# EAGLE design MD201x (EAGLE 9.5.2)

## Sheet 1 of 4
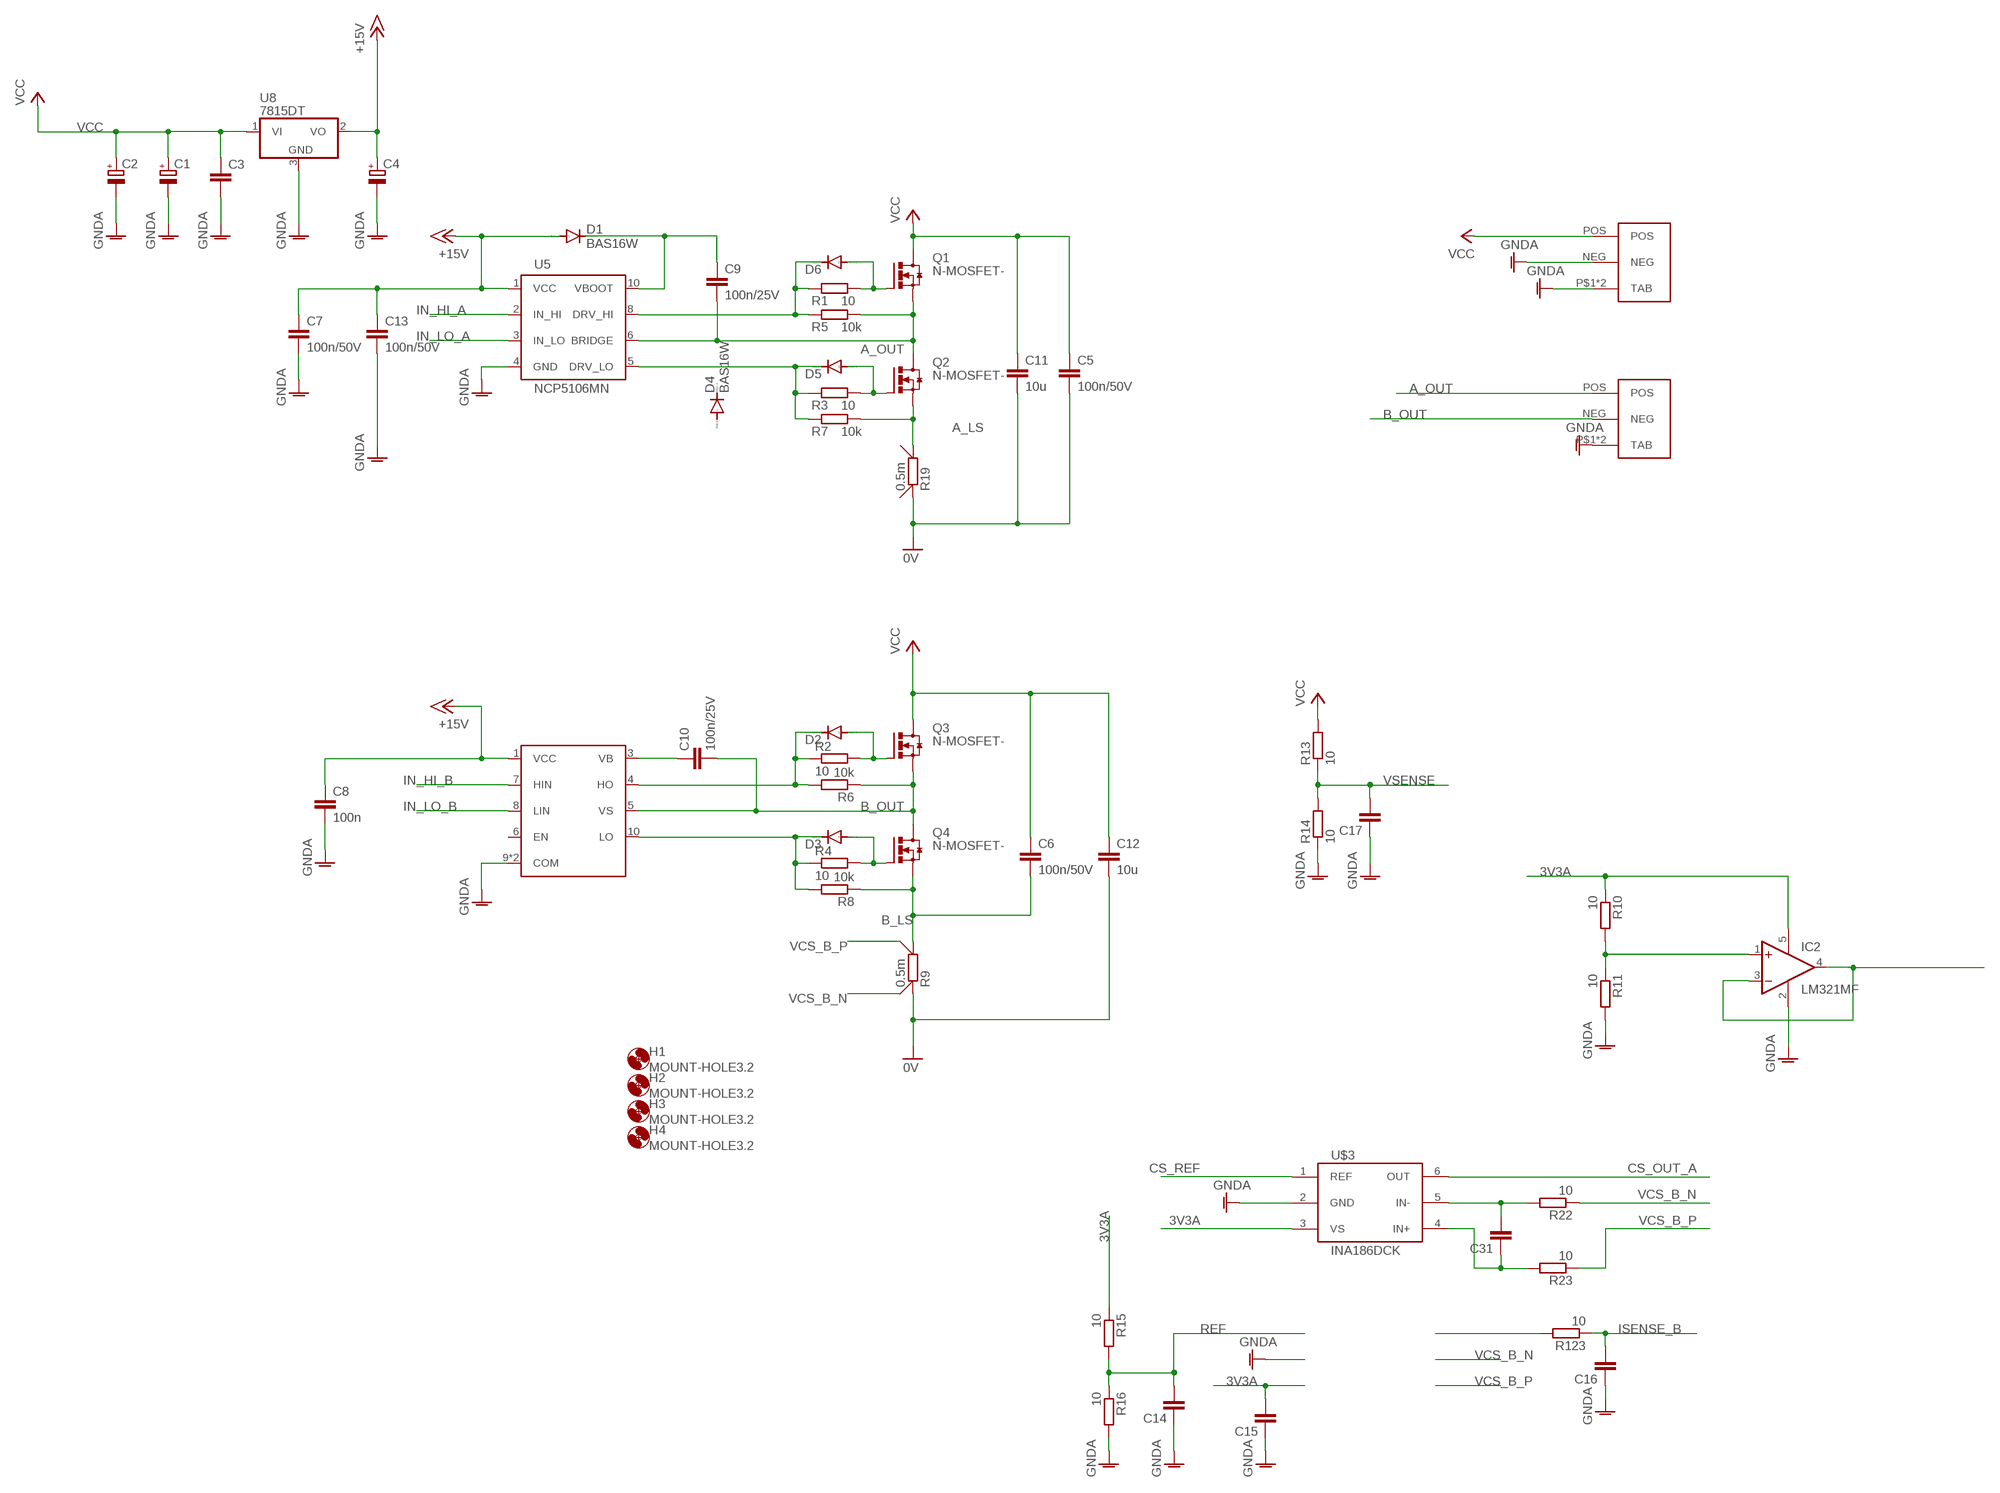
[diagram p0: schematic, sheet 1]

### Parts
C1  CPOL-EUE5-10.5  [E5-10,5]
C2  CPOL-EUE5-10.5  [E5-10,5]
C3  C-EUC0603  [C0603]
C4  CPOL-EUE2.5-5  [E2,5-5]
C5  100n/50V  C-EUC0603  [C0603]
C6  100n/50V  C-EUC0603  [C0603]
C7  100n/50V  C-EUC0603  [C0603]
C8  100n  C-EUC0603  [C0603]
C9  100n/25V  C-EUC0603  [C0603]
C10  100n/25V  C-EUC0603  [C0603]
C11  10u  C-EUC1210  [C1210]
C12  10u  C-EUC1210  [C1210]
C13  100n/50V  C-EUC0603  [C0603]
C14  C-EUC0603  [C0603]
C15  C-EUC0603  [C0603]
C16  C-EUC0603  [C0603]
C17  C-EUC0603  [C0603]
C31  C-EUC0603  [C0603]
D1  BAS16W  DIODE-SOD323-R  [SOD323-R]
D2  DIODE-SOD523  [SOD523]
D3  DIODE-SOD523  [SOD523]
D4  BAS16W  DIODE-SOD323-R  [SOD323-R]
D5  DIODE-SOD523  [SOD523]
D6  DIODE-SOD523  [SOD523]
H1  MOUNT-HOLE3.2  [3,2]
H2  MOUNT-HOLE3.2  [3,2]
H3  MOUNT-HOLE3.2  [3,2]
H4  MOUNT-HOLE3.2  [3,2]
IC2  LM321MF  [SOT23-5]
Q1  N-MOSFET-  [SOT669]
Q2  N-MOSFET-  [SOT669]
Q3  N-MOSFET-  [SOT669]
Q4  N-MOSFET-  [SOT669]
R1  10  R-EU_R0603  [R0603]
R2  10  R-EU_R0603  [R0603]
R3  10  R-EU_R0603  [R0603]
R4  10  R-EU_R0603  [R0603]
R5  10k  R-EU_R0603  [R0603]
R6  10k  R-EU_R0603  [R0603]
R7  10k  R-EU_R0603  [R0603]
R8  10k  R-EU_R0603  [R0603]
R9  0.5m  CSS2H-2512  [CSS2H-2512]
R10  10  R-EU_R0603  [R0603]
R11  10  R-EU_R0603  [R0603]
R13  10  R-EU_R0603  [R0603]
R14  10  R-EU_R0603  [R0603]
R15  10  R-EU_R0603  [R0603]
R16  10  R-EU_R0603  [R0603]
R19  0.5m  CSS2H-2512  [CSS2H-2512]
R22  10  R-EU_R0603  [R0603]
R23  10  R-EU_R0603  [R0603]
R123  10  R-EU_R0603  [R0603]
U5  NCP5106MN  [SON80P400X400X100-11T275X300]
U8  7815DT  [TO252]
U$1  XT60PW-M  [XT60PW-M]
U$2  XT60PW-F  [XT60PW-F]
U$3  INA186DCK  [SOT65P210X110-6]
U$4  DGD05473FN  [SON50P300X300X80-11T165X260]

### Nets
0V: C5.2 C11.2 C12.2 R9.1 R19.1
3V3A: C15.2 IC2.5(V+) R10.1 R15.1 U$3.3(VS) ; also sheet 3
+15V: C4.+ C7.1 C8.1 C13.1 D1.A U5.1(VCC) U8.2(VO) U$4.1(VCC) ; also sheet 4
A_LS: Q2.1(SOURCE) Q2.2(SOURCE) Q2.3(SOURCE) R7.1 R19.2
A_OUT: C9.2 Q1.1(SOURCE) Q1.2(SOURCE) Q1.3(SOURCE) Q2.5(DRAIN) R5.1 U5.6(BRIDGE) U$2.POS
B_LS: C6.2 Q4.1(SOURCE) Q4.2(SOURCE) Q4.3(SOURCE) R8.1 R9.2
B_OUT: C10.2 Q3.1(SOURCE) Q3.2(SOURCE) Q3.3(SOURCE) Q4.5(DRAIN) R6.1 U$2.NEG U$4.5(VS)
CS_OUT_A: U$3.6(OUT)
CS_REF: U$3.1(REF)
GNDA: C1.- C2.- C3.2 C4.- C7.2 C8.2 C13.2 C14.1 C15.1 C16.1 C17.1 IC2.2(V-) R11.2 R14.1 R16.2 U5.4(GND) U8.3(GND) U$1.NEG U$1.P$1(TAB) U$1.P$2(TAB) U$2.P$1(TAB) U$2.P$2(TAB) U$3.2(GND) U$4.9(COM) U$4.11(COM) ; also sheet 2,3,4
IN_HI_A: U5.2(IN_HI) ; also sheet 3
IN_HI_B: U$4.7(HIN) ; also sheet 3
IN_LO_A: U5.3(IN_LO)
IN_LO_B: U$4.8(LIN)
ISENSE_B: C16.2 R123.1
N$1: D6.C R1.1 R5.2 U5.8(DRV_HI)
N$2: D2.C R2.1 R6.2 U$4.4(HO)
N$4: D6.A Q1.4(GATE) R1.2
N$5: D3.C R4.1 R8.2 U$4.10(LO)
N$6: R123.2
N$11: D5.C R3.1 R7.2 U5.5(DRV_LO)
N$12: D2.A Q3.4(GATE) R2.2
N$14: IC2.1(+IN) R10.2 R11.1
N$15: C31.2 R22.2 U$3.5(IN-)
N$22: C31.1 R23.2 U$3.4(IN+)
N$24: IC2.3(-IN) IC2.4(OUT)
N$61: D5.A Q2.4(GATE) R3.2
N$64: D3.A Q4.4(GATE) R4.2
N$67: C10.1 U$4.3(VB)
N$73: C9.1 D1.C U5.10(VBOOT)
REF: C14.2 R15.2 R16.1
VCC: C1.+ C2.+ C3.1 C5.1 C6.1 C11.1 C12.1 Q1.5(DRAIN) Q3.5(DRAIN) R13.2 U8.1(VI) U$1.POS
VCS_B_N: R9.1S R22.1
VCS_B_P: R9.2S R23.1
VSENSE: C17.2 R13.1 R14.2 ; also sheet 3
Unconnected: D4.A D4.C R19.1S R19.2S U$4.6(EN)

## Sheet 2 of 4
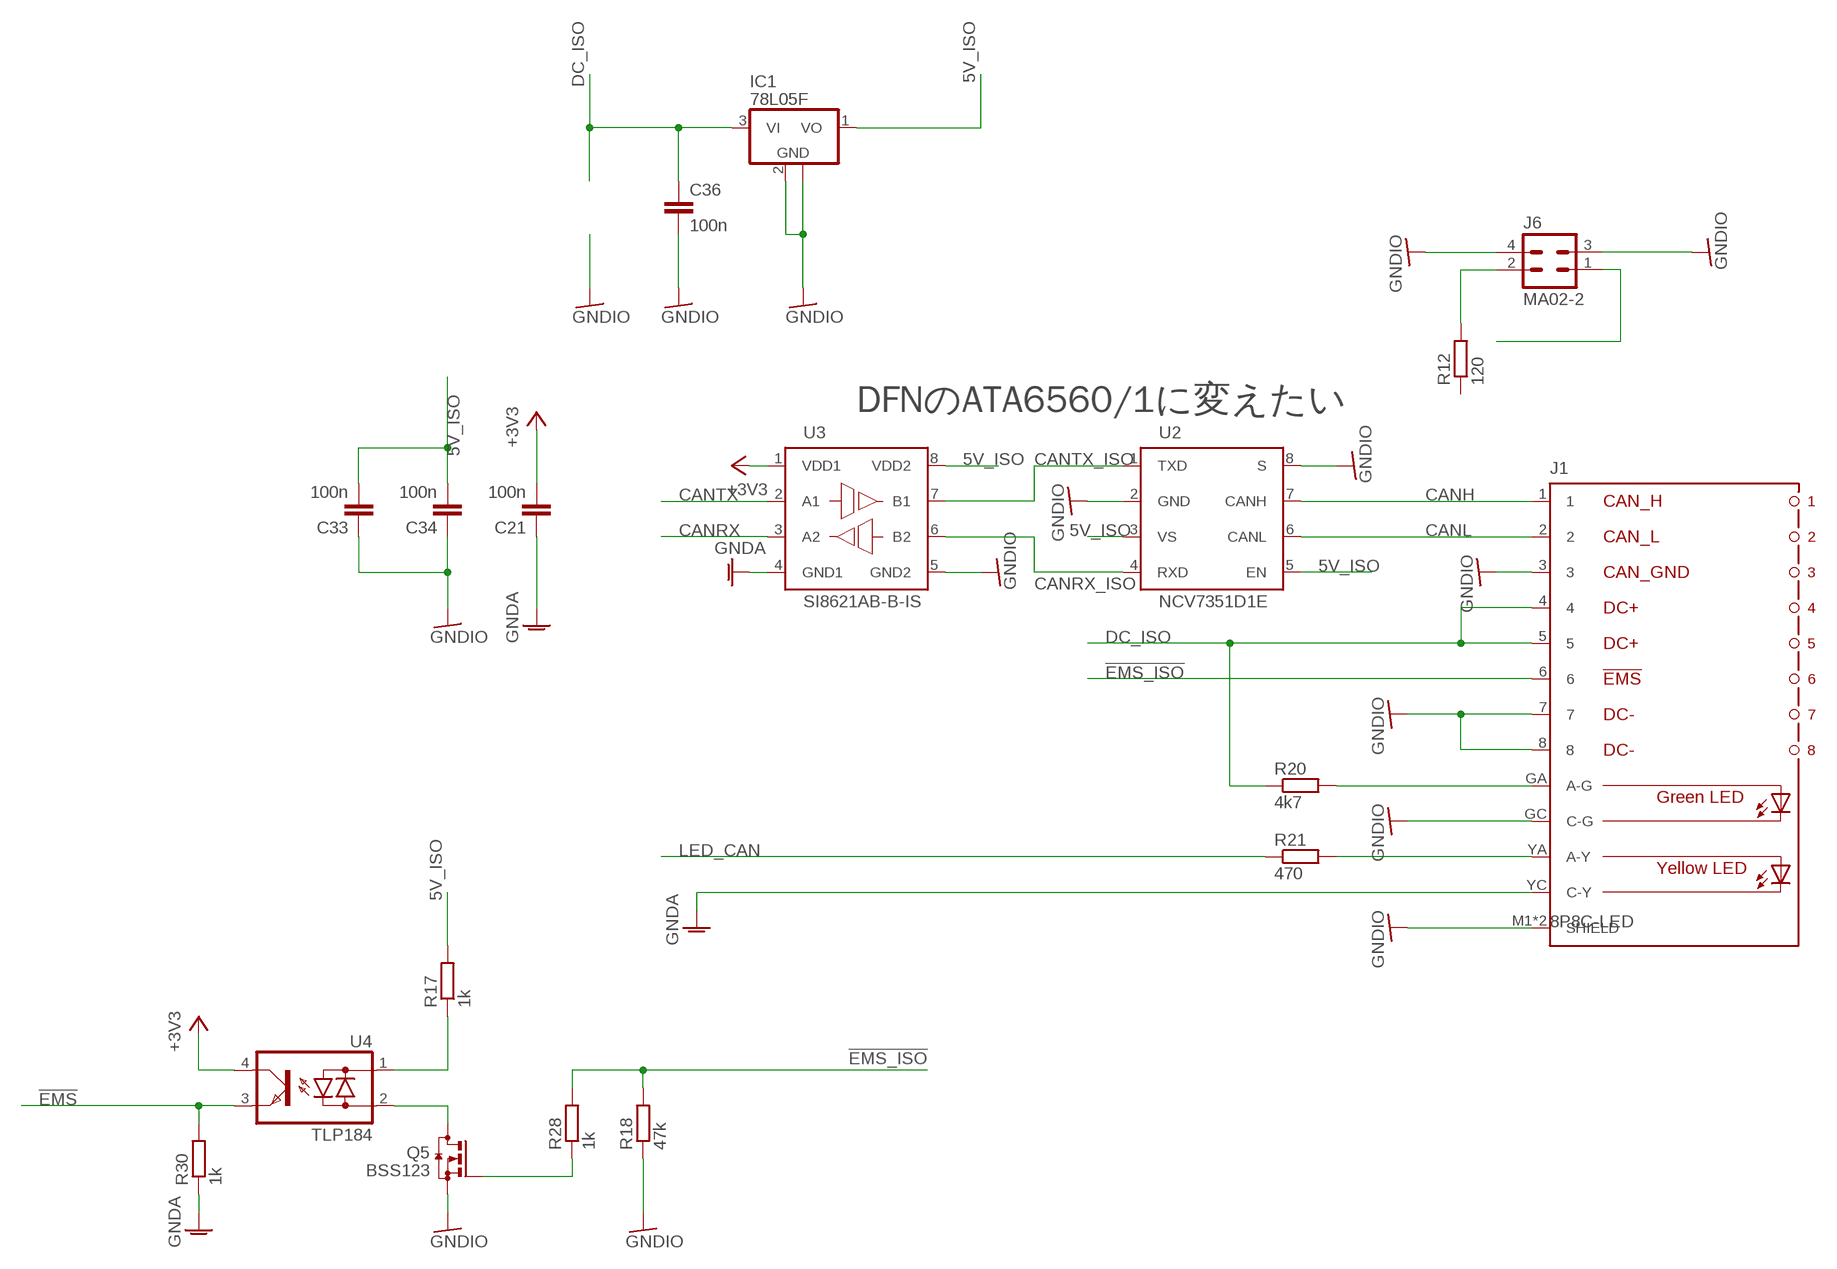
[diagram p1: schematic, sheet 2]

### Parts
C21  100n  C-EUC0603  [C0603]
C33  100n  C-EUC0603  [C0603]
C34  100n  C-EUC0603  [C0603]
C36  100n  C-EUC1210  [C1210]
IC1  78L05F  [SOT89]
J1  8P8C-LED  [8P8C-LED]
J6  MA02-2  [MA02-2W]
Q5  BSS123  [SOT23]
R12  120  R-EU_R0603  [R0603]
R17  1k  R-EU_R0603  [R0603]
R18  47k  R-EU_R0603  [R0603]
R20  4k7  R-EU_R0603  [R0603]
R21  470  R-EU_R0603  [R0603]
R28  1k  R-EU_R0603  [R0603]
R30  1k  R-EU_R0603  [R0603]
U2  NCV7351D1E  [SO08]
U3  SI8621AB-B-IS  [SO08]
U4  TLP184  [11-4M1S]

### Nets
5V_ISO: C33.2 C34.2 IC1.1(VO) R17.2 U2.3(VS) U2.5(EN) U3.8(VDD2)
!EMS: R30.2 U4.3(E) ; also sheet 3
!EMS_ISO: J1.6 R18.2 R28.2
+3V3: C21.2 U3.1(VDD1) U4.4(C) ; also sheet 3,4
CANH: J1.1 U2.7(CANH)
CANL: J1.2 U2.6(CANL)
CANRX: U3.3(A2) ; also sheet 3
CANRX_ISO: U2.4(RXD) U3.6(B2)
CANTX: U3.2(A1) ; also sheet 3
CANTX_ISO: U2.1(TXD) U3.7(B1)
DC_ISO: C36.1 IC1.3(VI) J1.4 J1.5 R20.1
GNDA: C21.1 J1.YC(C-Y) R30.1 U3.4(GND1) ; also sheet 1,3,4
GNDIO: C33.1 C34.1 C36.2 IC1.2(GND) IC1.2@1(GND) J1.3 J1.7 J1.8 J1.GC(C-G) J1.M1(SHIELD) J1.M2(SHIELD) J6.3 J6.4 Q5.2(S) R18.1 U2.2(GND) U2.8(S) U3.5(GND2)
LED_CAN: R21.1 ; also sheet 3
N$8: Q5.1(G) R28.1
N$9: J6.2 R12.2
N$13: J6.1
N$16: R17.1 U4.1(AC1)
N$17: Q5.3(D) U4.2(AC2)
N$18: J1.GA(A-G) R20.2
N$20: J1.YA(A-Y) R21.2
Unconnected: R12.1

### Notes on the sheet
- DFNのATA6560/1に変えたい

## Sheet 3 of 4
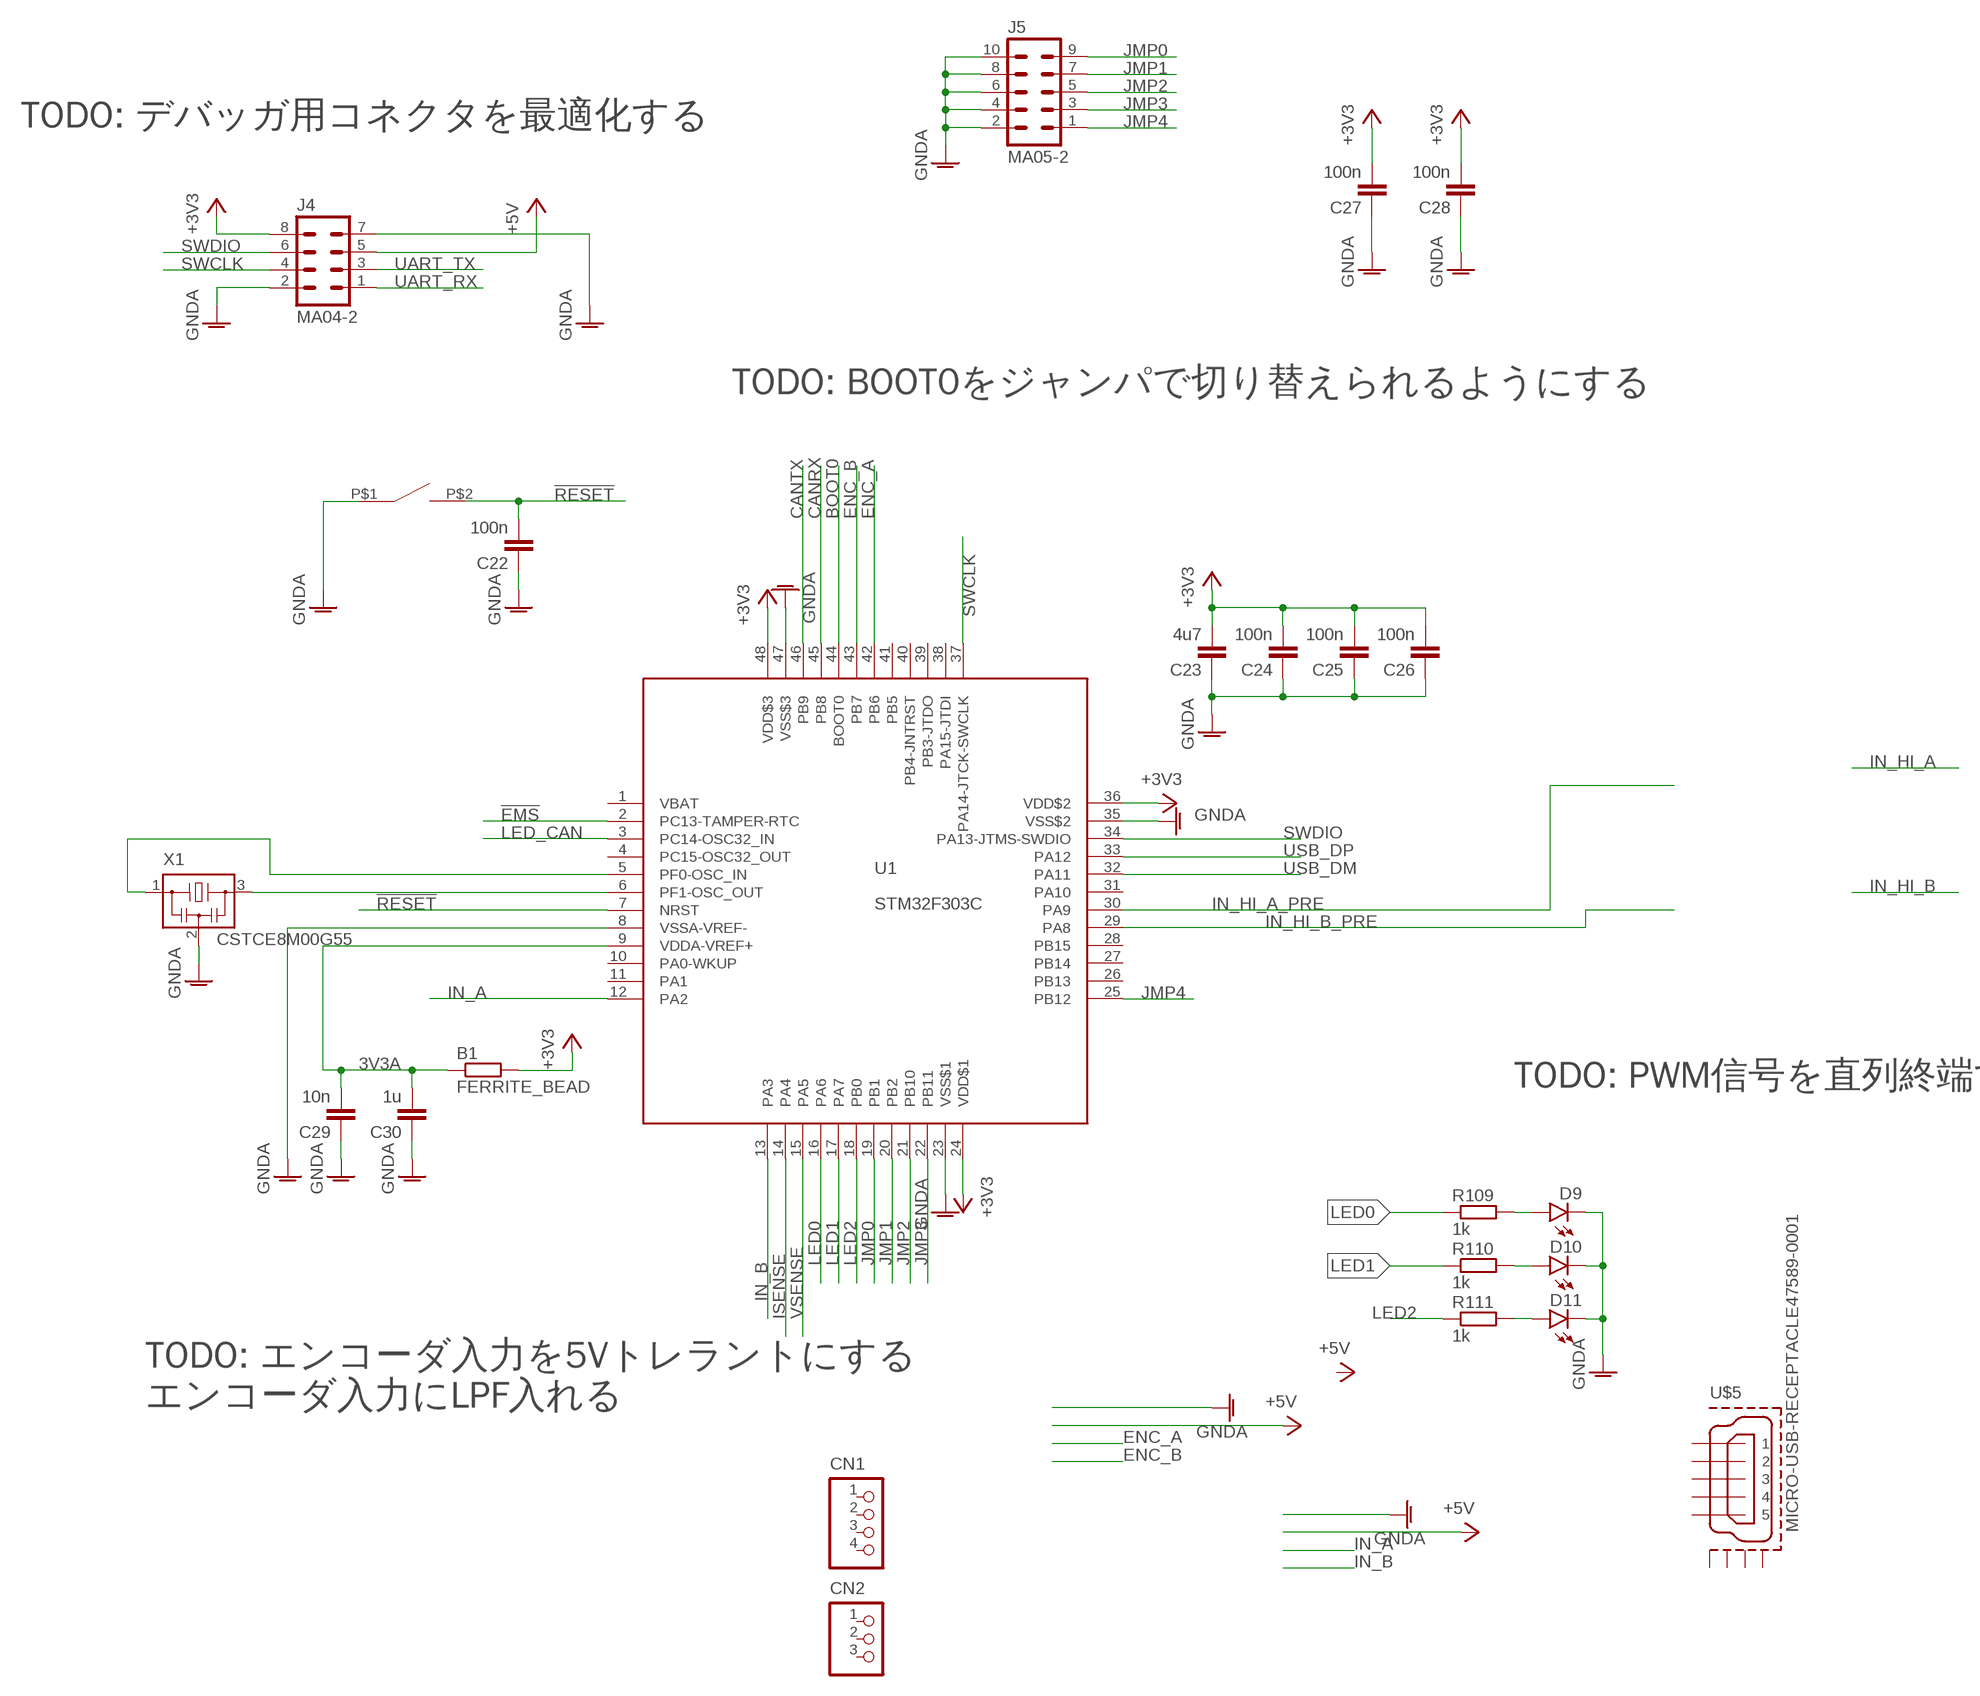
[diagram p2: schematic, sheet 3]

### Parts
B1  FERRITE_BEAD  R-EU_R0603  [R0603]
C22  100n  C-EUC0603  [C0603]
C23  4u7  C-EUC0805  [C0805]
C24  100n  C-EUC0603  [C0603]
C25  100n  C-EUC0603  [C0603]
C26  100n  C-EUC0603  [C0603]
C27  100n  C-EUC0603  [C0603]
C28  100n  C-EUC0603  [C0603]
C29  10n  C-EUC0603  [C0603]
C30  1u  C-EUC0603  [C0603]
CN1  S4B-XASK-1  [S4B-XASK-1]
CN2  S3B-XASK-1  [S3B-XASK-1]
D9  LEDCHIPLED_0805  [CHIPLED_0805]
D10  LEDCHIPLED_0805  [CHIPLED_0805]
D11  LEDCHIPLED_0805  [CHIPLED_0805]
J4  MA04-2  [MA04-2W]
J5  MA05-2  [MA05-2W]
R109  1k  R-EU_R0603  [R0603]
R110  1k  R-EU_R0603  [R0603]
R111  1k  R-EU_R0603  [R0603]
S1  SWITCH_TACTILETOP  [SWITCH_TACTILE_3X6]
U1  STM32F303C  [LQFP48]
U$5  MICRO-USB-RECEPTACLE47589-0001  [47589-0001]
X1  CSTCE8M00G55  [CSTCE8M00G55]

### Nets
3V3A: B1.1 C29.2 C30.2 U1.9(VDDA-VREF+) ; also sheet 1
!EMS: U1.2(PC13-TAMPER-RTC) ; also sheet 2
!RESET: C22.2 S1.P$2 U1.7(NRST)
+3V3: B1.2 C23.2 C24.2 C25.2 C26.2 C27.2 C28.2 J4.8 U1.24(VDD$1) U1.36(VDD$2) U1.48(VDD$3) ; also sheet 2,4
+5V: J4.5 ; also sheet 4
BOOT0: U1.44(BOOT0)
CANRX: U1.45(PB8) ; also sheet 2
CANTX: U1.46(PB9) ; also sheet 2
ENC_A: U1.42(PB6)
ENC_B: U1.43(PB7)
GNDA: C22.1 C23.1 C24.1 C25.1 C26.1 C27.1 C28.1 C29.1 C30.1 D9.C D10.C D11.C J4.2 J4.7 J5.2 J5.4 J5.6 J5.8 J5.10 S1.P$1 U1.8(VSSA-VREF-) U1.23(VSS$1) U1.35(VSS$2) U1.47(VSS$3) X1.2 ; also sheet 1,2,4
IN_A: U1.12(PA2)
IN_B: U1.13(PA3)
IN_HI_A_PRE: U1.30(PA9)
IN_HI_B_PRE: U1.29(PA8)
ISENSE: U1.14(PA4)
JMP0: J5.9 U1.19(PB1)
JMP1: J5.7 U1.20(PB2)
JMP2: J5.5 U1.21(PB10)
JMP3: J5.3 U1.22(PB11)
JMP4: J5.1 U1.25(PB12)
LED0: R109.1 U1.16(PA6)
LED1: R110.1 U1.17(PA7)
LED2: R111.1 U1.18(PB0)
LED_CAN: U1.3(PC14-OSC32_IN) ; also sheet 2
N$3: D10.A R110.2
N$7: D9.A R109.2
N$10: U1.6(PF1-OSC_OUT) X1.3
N$19: U1.5(PF0-OSC_IN) X1.1
N$21: D11.A R111.2
SWCLK: J4.4 U1.37(PA14-JTCK-SWCLK)
SWDIO: J4.6 U1.34(PA13-JTMS-SWDIO)
UART_RX: J4.1
UART_TX: J4.3
USB_DM: U1.32(PA11)
USB_DP: U1.33(PA12)
VSENSE: U1.15(PA5) ; also sheet 1
Unconnected: CN1.1 CN1.2 CN1.3 CN1.4 CN2.1 CN2.2 CN2.3 U1.1(VBAT) U1.4(PC15-OSC32_OUT) U1.10(PA0-WKUP) U1.11(PA1) U1.26(PB13) U1.27(PB14) U1.28(PB15) U1.31(PA10) U1.38(PA15-JTDI) U1.39(PB3-JTDO) U1.40(PB4-JNTRST) U1.41(PB5) U$5.1 U$5.2 U$5.3 U$5.4 U$5.5 U$5.CASING1(GND1) U$5.CASING2(GND2) U$5.CASING3(GND3) U$5.CASING4(GND4) U$5.P$1(GND1) U$5.P$2(GND1) U$5.P$3(GND2) U$5.P$4(GND2)

### Notes on the sheet
- TODO: デバッガ用コネクタを最適化する
- TODO: BOOT0をジャンパで切り替えられるようにする
- TODO: PWM信号を直列終端する
- TODO: エンコーダ入力を5Vトレラントにする
  エンコーダ入力にLPF入れる

## Sheet 4 of 4
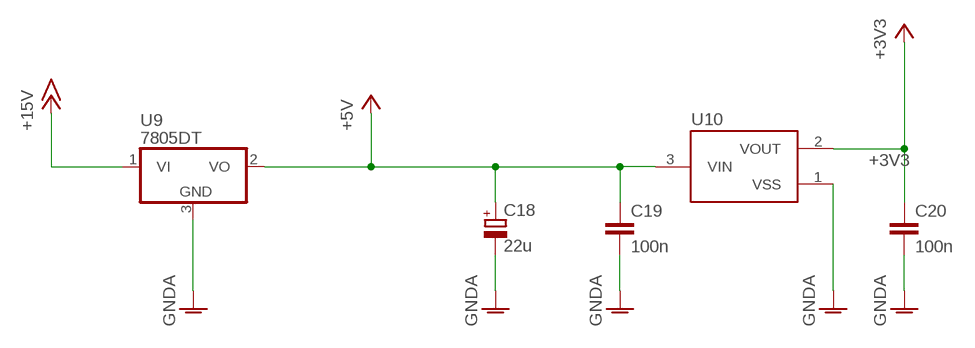
[diagram p3: schematic, sheet 4]

### Parts
C18  22u  CPOL-EUE2.5-5  [E2,5-5]
C19  100n  C-EUC0603  [C0603]
C20  100n  C-EUC0603  [C0603]
U9  7805DT  [TO252]
U10  XC6206  [SOT95P240X110-3]

### Nets
+3V3: C20.1 U10.2(VOUT) ; also sheet 2,3
+5V: C18.+ C19.1 U9.2(VO) U10.3(VIN) ; also sheet 3
+15V: U9.1(VI) ; also sheet 1
GNDA: C18.- C19.2 C20.2 U9.3(GND) U10.1(VSS) ; also sheet 1,2,3

## Library data of the parts
B1 R1-R8 R10 R11 R13-R16 R22 R23 R109-R111 R123 = rcl:R-EU_: RESISTOR, European symbol
C1 C2 C4 C18 = rcl:CPOL-EU: POLARIZED CAPACITOR, European symbol
C3 C5-C13 C19-C30 C33 C34 C36 = rcl:C-EU: CAPACITOR, European symbol
C14-C17 C31 = rcl:C-EU: CAPACITOR, European symbol; SPICEPREFIX: C
CN1 = jst-xa:S4B-XASK-1: Wire-to-Board 2.5mm pitch top mount connector Source: http://www.jst-mfg.com/product/pdf/jpn/XA1.pdf http://www.jst-mfg.com/product/detail.php?series=272
CN2 = jst-xa:S3B-XASK-1: Wire-to-Board 2.5mm pitch top mount connector Source: http://www.jst-mfg.com/product/pdf/jpn/XA1.pdf http://www.jst-mfg.com/product/detail.php?series=272
D1-D6 = diode:DIODE-: DIODE
D9-D11 = led:LED: LED OSRAM: - CHIPLED LG R971, LG N971, LY N971, LG Q971, LY Q971, LO R971, LY R971 LH N974, LH R974 LS Q976, LO Q976, LY Q976 LO Q996 - Hyper CHIPLED LW Q18S LB Q993, LB Q99A, LB R99A - SideLED LS A670, LO A670, LY A670, LG A670, LP A670 LB A673, LV A673, LT A673, LW A673 LH A674 LY A675 LS A676, LA A676, LO A676, LY A676, LW A676 LS A679, LY A679, LG A679 - Hyper Micro SIDELED® LS Y876, LA Y876, LO Y876, LY Y876 LT Y87S - SmartLED LW L88C, LW L88S LB L89C, LB L89S, LG L890 LS L89K, LO L89K, LY L89K LS L896, LA L896, LO L896, LY L896 - TOPLED LS T670, LO T670, LY T670, LG T670, LP T670 LSG T670, LSP T670, LSY T670, LOP T670, LYG T670 LG T671, LOG T671, LSG T671 LB T673, LV T673, LT T673, LW T673 LH T674 LS T676, LA T676, LO T676, LY T676, LB T676, LH T676, LSB T676, LW T676 LB T67C, LV T67C, LT T67C, LS T67K, LO T67K, LY T67K, LW E67C LS E67B, LA E67B, LO E67B, LY E67B, LB E67C, LV E67C, LT E67C LW T67C LS T679, LY T679, LG T679 LS T770, LO T770, LY T770, LG T770, LP T770 LB T773, LV T773, LT T773, LW T773 LH T774 LS E675, LA E675, LY E675, LS T675 LS T776, LA T776, LO T776, LY T776, LB T776 LHGB T686 LT T68C, LB T68C - Hyper Mini TOPLED® LB M676 - Mini TOPLED Santana® LG M470 LS M47K, LO M47K, LY M47K Source: http://www.osram.convergy.de LUXEON: - LUMILED® LXK2-PW12-R00, LXK2-PW12-S00, LXK2-PW14-U00, LXK2-PW14-V00 LXK2-PM12-R00, LXK2-PM12-S00, LXK2-PM14-U00 LXK2-PE12-Q00, LXK2-PE12-R00, LXK2-PE12-S00, LXK2-PE14-T00, LXK2-PE14-U00 LXK2-PB12-K00, LXK2-PB12-L00, LXK2-PB12-M00, LXK2-PB14-N00, LXK2-PB14-P00, LXK2-PB14-Q00 LXK2-PR12-L00, LXK2-PR12-M00, LXK2-PR14-Q00, LXK2-PR14-R00 LXK2-PD12-Q00, LXK2-PD12-R00, LXK2-PD12-S00 LXK2-PH12-R00, LXK2-PH12-S00 LXK2-PL12-P00, LXK2-PL12-Q00, LXK2-PL12-R00 Source: www.luxeon.com KINGBRIGHT: KA-3528ASYC Source: www.kingbright.com
H1-H4 = holes:MOUNT-HOLE: MOUNTING HOLE with drill center marker
IC1 = linear:78L*: POSITOIV-VOLTAGE REGULATORS Output up to 100 mA Source: Datasheet <http://focus.ti.com/lit/ds/symlink/ua78l05.pdf>
IC2 = linear:LM321?*: Low Power Single Op Amp Source: http://cache.national.com/ds/LM/LM321.pdf
J1 = con-rj45:8P8C-LED: generic 8P8C connector with two LED's; OC_FARNELL: unknown; OC_NEWARK: unknown
J4 = con-headers:MA04-2
J5 = con-headers:MA05-2
J6 = con-headers:MA02-2
Q1-Q4 = nexperia:N-MOSFET-*
Q5 = transistor-small-signal:BSS123: N-CHANNEL MOS FET
R9 R19 = r_shunt:CSS2H-2512: Bourns Model CSS2H-2512 Series Current Sense Resistor <https://www.bourns.com/docs/Product-Datasheets/css2h-2512.pdf>
R12 R17 R18 R20 R21 R28 R30 = rcl:R-EU_: RESISTOR, European symbol; SPICEPREFIX: R
S1 = switch-tactile:SWITCH_TACTILE
U1 = stm32_mcu:STM32F303C*
U2 = on-semi:NCV7351D1E: High Speed CAN Transceiver Source: NCV7351-D.PDF <http://www.onsemi.com/PowerSolutions/document/NCV7351-D.PDF>
U3 = silabs:SI8621AB-B-IS: 1 Mbps Digital Isolator 1 Mbps, 2.5 kVRMS Digital Isolator Source: Si86xx.pdf <https://www.silabs.com/documents/public/data-sheets/Si86xx.pdf>
U4 = md201x:TLP184
U5 = on-semi:NCP5106
U8 U9 = linear:78*: Positive VOLTAGE REGULATOR Source: http://cache.national.com/ds/LM/LM78L05.pdf http://www.fairchildsemi.com/ds/LM/LM7805.pdf
U10 = torex:XC6206
U$1 = lib_ysk:XT60PW-M: XT60PW-M shrouded male connector
U$2 = lib_ysk:XT60PW-F
U$3 = lib_ysk:INA186
U$4 = lib_ysk:DGD05473
U$5 = con-molex-usb:MICRO-USB-RECEPTACLE: MICRO USB RECEPTACLES Micro-USB Receptacles, SMT, Lead-Free from MOLEX <http://www.molex.com/>. (C) 2014 Tomasz Boleslaw CEDRO, cederom@tlen.pl, http://www.tomek.cedro.info. Version 0.1 (2014-01-17): Initial release. Version 0.2 (2014-02-06): Updated 47589-0001 footprint pins/pads/milling. Following devices are included: 1. 47589-0001 Micro-USB AB Receptacle, Bottom Mount, SMT, Lead-Free <http://www.molex.com/molex/products/datasheet.jsp?part=active/0475890001_IO_CONNECTORS.xml> (Technical Drawing <http://www.molex.com/pdm_docs/sd/475890001_sd.pdf>).
X1 = resonator:CSTCE8M00G55

## Net classes
1 current_sense: width 0.254 mm

## Board
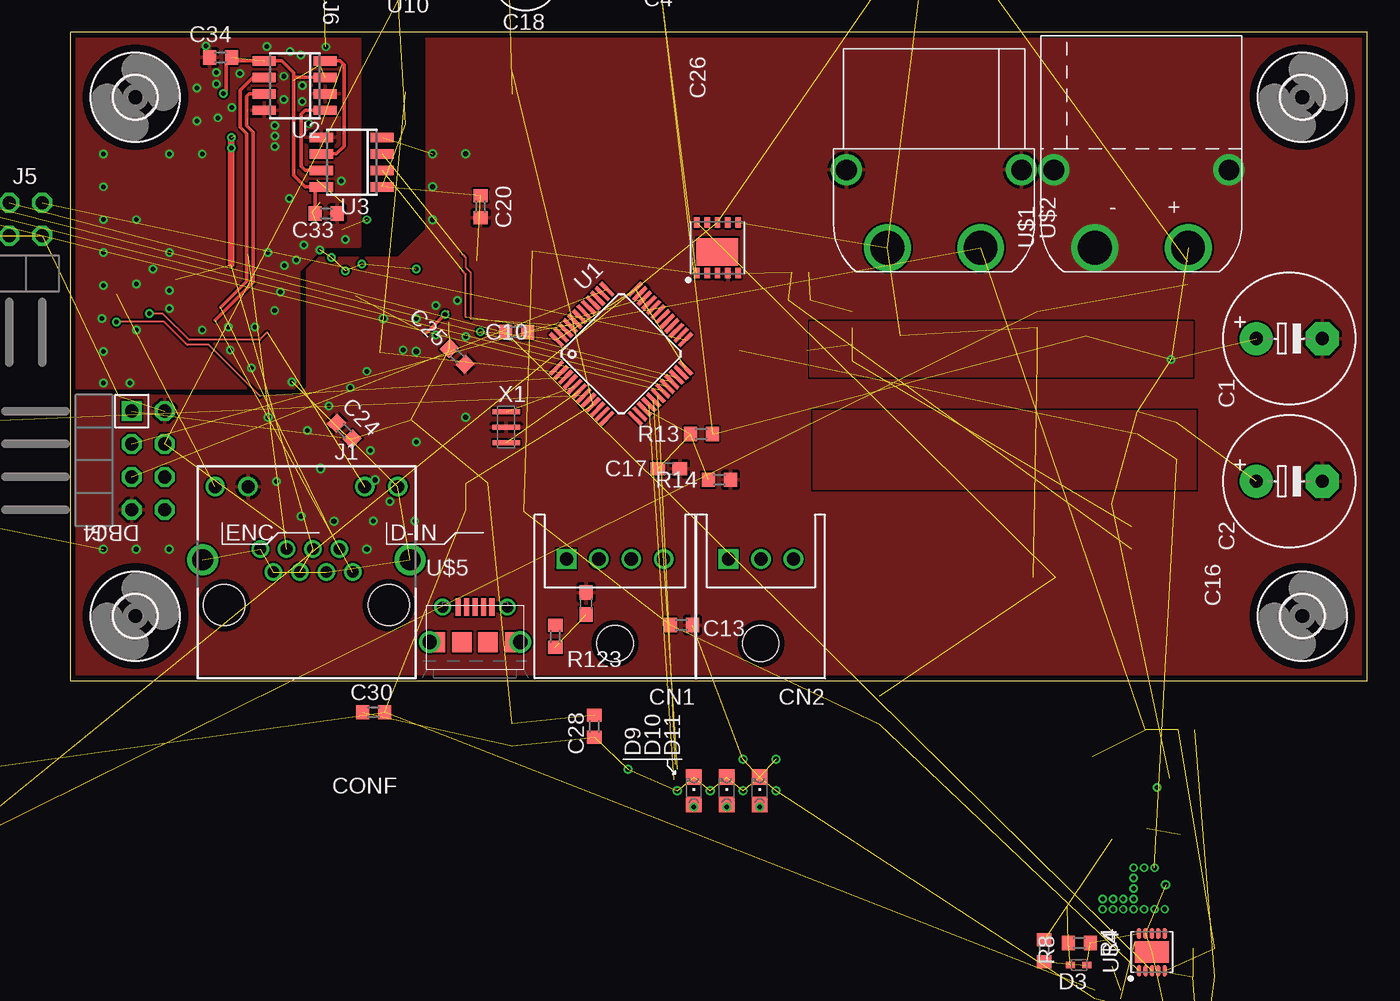
[diagram p4: board, top side]
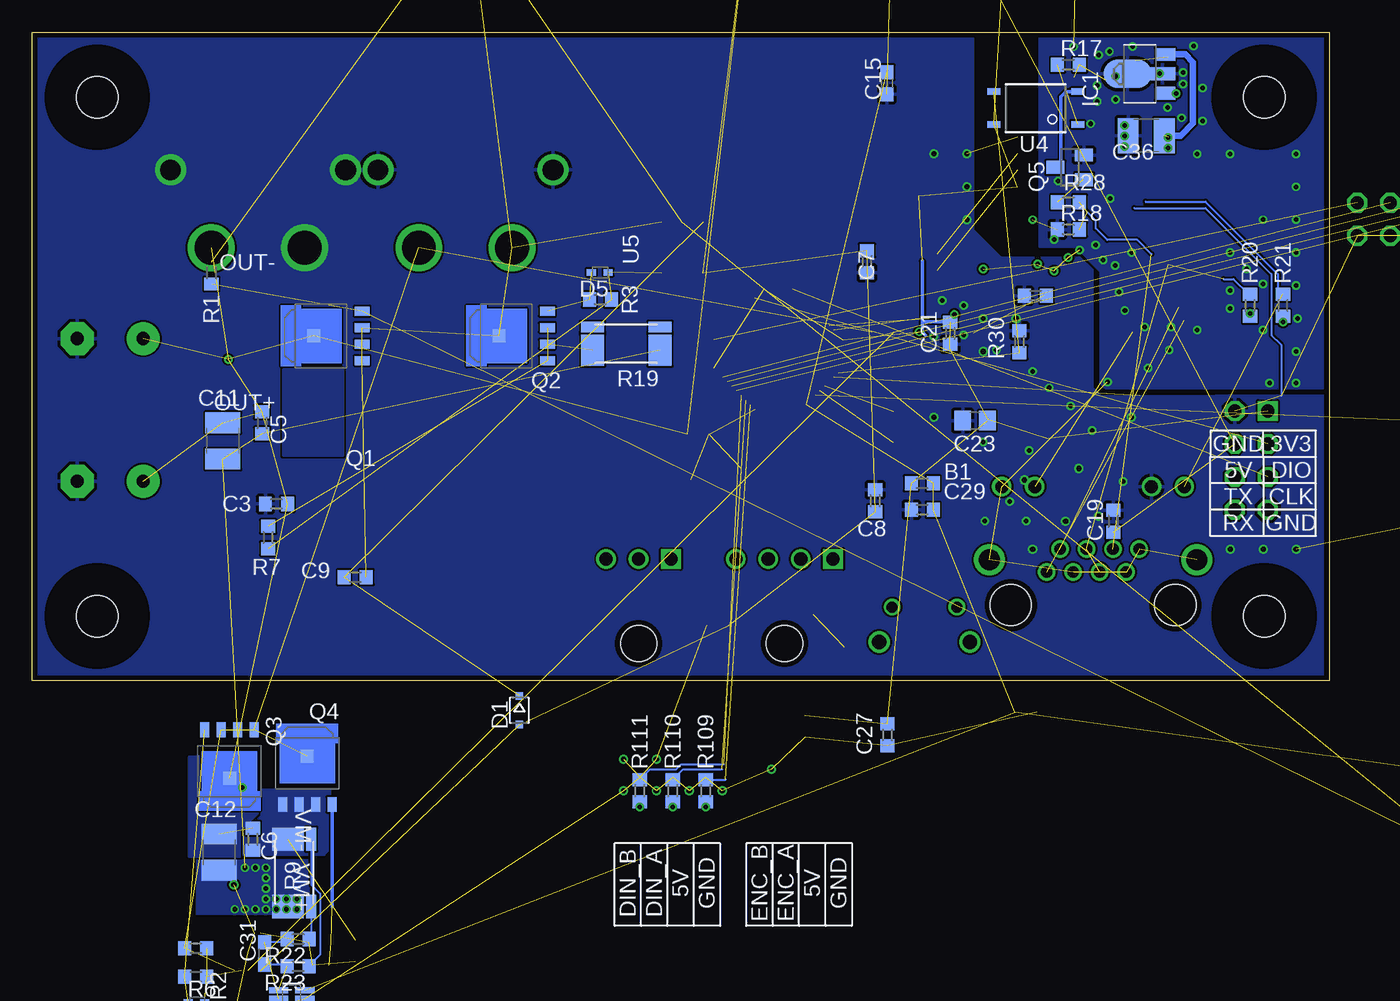
[diagram p5: board, bottom side, seen from below]

Size 100 x 50 mm. Coordinates in mm from the lower left corner, seen from the top.
Outline: 0,0 100,0 100,50 0,50 0,0
Copper layers (1+2*15+16): Top 0.035mm / dielectric 1.5mm / Route2 0.035mm / dielectric 0.15mm / Route15 0.035mm / dielectric 0.2mm / Bottom 0.035mm
Design rules "seeed_2layers *": minimum track width 6mil, minimum drill 0.2mm, track to track 6mil, track to pad 6mil, pad to pad 6mil, via to via 6mil, smd to smd 0mil, copper to edge 0.4mm, drill to drill 12mil, minimum pad ring 0.15mm, minimum via ring 0.15mm, stop-mask expansion 4mil, vias tented up to drill 50mil, thermal gap 10mil
tKeepout: 11 lines
bKeepout: 6 lines

### Footprints (pad centres in the part's own frame; a part is rotated, then mirrored left to right if it is on the bottom)
R0603 = smd 1 x 1.1: 1 -0.85,0; 2 0.85,0
E5-10,5 = drill 1.016 pad 2.54: + -2.54,0 | drill 1.016 pad 2.54 octagon: - 2.54,0
C0603 = smd 1 x 1.1: 1 -0.85,0; 2 0.85,0
E2,5-5 = drill 0.813 pad 1.6: + -1.27,0 | drill 0.813 pad 1.6 octagon: - 1.27,0
C1210 = smd 1.6 x 2.7: 1 -1.4,0; 2 1.4,0
C0603' = smd 1.1 x 1: 1 -0.85,0; 2 0.85,0
C0805 = smd 1.3 x 1.5: 1 -0.95,0; 2 0.95,0
S4B-XASK-1 = drill 1.016 square: 1 3.75,0 | drill 1.016: 2 1.25,0; 3 -1.25,0; 4 -3.75,0 | hole 2.8: 0,6.5
S3B-XASK-1 = drill 1.016 square: 1 2.5,0 | drill 1.016: 2 0,0; 3 -2.5,0 | hole 2.8: 0,6.5
SOD323-R = smd 0.6 x 0.6: A 1.1,0; C -1.1,0
SOD523 = smd 0.7 x 0.5: A 0.7,0; C -0.6,0
CHIPLED_0805 = smd 1.2 x 1.2: A 0,-1.05; C 0,1.05
3,2 = hole 3.2: 0,0
SOT89 = smd 1 x 1.5: 1 -1.499,-1.981; 3 1.499,-1.981 | smd 1 x 2: 2 0,-1.727 | smd 2.2 x 3.7: 2@1 0,0.94
SOT23-5 = smd 0.6 x 1.2: 1 -0.95,-1.306; 2 0,-1.306; 3 0.95,-1.306; 4 0.95,1.306; 5 -0.95,1.306
8P8C-LED = drill 0.9 pad 1.3: 1 3.57,-3.81; 2 2.55,-2.03; 3 1.53,-3.81; 4 0.51,-2.03; 5 -0.51,-3.81; 6 -1.53,-2.03; 7 -2.55,-3.81; 8 -3.57,-2.03 | drill 1 pad 1.422: GA 4.5,2.78; GC 7.04,2.78; YA -7.04,2.78; YC -4.5,2.78 | drill 1.6 pad 2.184: M1 -8,-2.85; M2 8,-2.85 | hole 3.2: 6.35,-6.35; -6.35,-6.35
MA04-2W = drill 1.016 octagon: 1 -3.81,-1.27; 2 -3.81,1.27; 3 -1.27,-1.27; 4 -1.27,1.27; 5 1.27,-1.27; 6 1.27,1.27; 7 3.81,-1.27 | drill 1.016 square: 8 3.81,1.27
MA05-2W = drill 1.016 octagon: 1 -5.08,-1.27; 2 -5.08,1.27; 3 -2.54,-1.27; 4 -2.54,1.27; 5 0,-1.27; 6 0,1.27; 7 2.54,-1.27; 8 2.54,1.27; 9 5.08,-1.27 | drill 1.016 square: 10 5.08,1.27
MA02-2W = drill 1.016 octagon: 1 -1.27,-1.27; 2 -1.27,1.27; 3 1.27,-1.27 | drill 1.016 square: 4 1.27,1.27
SOT669 = smd 1.15 x 0.7: 1 -2.725,1.905; 2 -2.725,0.635; 3 -2.725,-0.635; 4 -2.725,-1.905 | smd 1 x 1: 5 1,0
SOT23 = smd 1 x 1.4: 1 -0.95,-1.1; 2 0.95,-1.1; 3 0,1.1
CSS2H-2512 = smd 1.8 x 2.4: 1 -2.6,0.5; 2 2.6,0.5 | smd 1.8 x 0.8: 1S -2.6,-1.3; 2S 2.6,-1.3
SWITCH_TACTILE_3X6 = smd 2 x 1: P$1 -3.6,0; P$2 3.6,0
LQFP48 = smd 1.4 x 0.3: 1 -4.3,2.75; 2 -4.3,2.25; 3 -4.3,1.75; 4 -4.3,1.25; 5 -4.3,0.75; 6 -4.3,0.25; 7 -4.3,-0.25; 8 -4.3,-0.75; 9 -4.3,-1.25; 10 -4.3,-1.75; 11 -4.3,-2.25; 12 -4.3,-2.75; 25 4.3,-2.75; 26 4.3,-2.25; 27 4.3,-1.75; 28 4.3,-1.25; 29 4.3,-0.75; 30 4.3,-0.25; 31 4.3,0.25; 32 4.3,0.75; 33 4.3,1.25; 34 4.3,1.75; 35 4.3,2.25; 36 4.3,2.75 | smd 0.3 x 1.4: 13 -2.75,-4.3; 14 -2.25,-4.3; 15 -1.75,-4.3; 16 -1.25,-4.3; 17 -0.75,-4.3; 18 -0.25,-4.3; 19 0.25,-4.3; 20 0.75,-4.3; 21 1.25,-4.3; 22 1.75,-4.3; 23 2.25,-4.3; 24 2.75,-4.3; 37 2.75,4.3; 38 2.25,4.3; 39 1.75,4.3; 40 1.25,4.3; 41 0.75,4.3; 42 0.25,4.3; 43 -0.25,4.3; 44 -0.75,4.3; 45 -1.25,4.3; 46 -1.75,4.3; 47 -2.25,4.3; 48 -2.75,4.3
SO08 = smd 0.72 x 1.78: 1 -1.905,-2.35; 2 -0.635,-2.35; 3 0.635,-2.35; 4 1.905,-2.35; 5 1.905,2.35; 6 0.635,2.35; 7 -0.635,2.35; 8 -1.905,2.35
11-4M1S = smd 1 x 0.5: 1 -3.24,1.27; 2 -3.24,-1.27; 3 3.24,-1.27; 4 3.24,1.27
SON80P400X400X100-11T275X300 = smd 0.8 x 0.42: 1 -1.96,1.6; 2 -1.96,0.8; 3 -1.96,0; 4 -1.96,-0.8; 5 -1.96,-1.6; 6 1.96,-1.6; 7 1.96,-0.8; 8 1.96,0; 9 1.96,0.8 | smd 0.811 x 0.42: 10 1.96,1.6 | smd 2.15 x 3.2: 11 -0.325,0
TO252 = smd 1 x 1.6: 1 -2.28,-4.8; 2 2.28,-4.8 | smd 5.4 x 6.2: 3 0,2.5
SOT95P240X110-3 = smd 1.18 x 0.609: 1 -1.024,0.95; 2 -1.024,-0.95; 3 1.024,0
XT60PW-M = drill 2.6: NEG -3.6,0; POS 3.6,0 | drill 1.6: P$1 -6.75,6; P$2 6.75,6
XT60PW-F = drill 2.6: NEG 3.6,0; POS -3.6,0 | drill 1.6: P$1 -6.75,6; P$2 6.75,6
SOT65P210X110-6 = smd 1.486 x 0.437: 1 -1.012,0.65; 2 -1.012,0; 3 -1.012,-0.65; 4 1.012,-0.65; 5 1.012,0; 6 1.012,0.65
SON50P300X300X80-11T165X260 = smd 0.86 x 0.3: 1 -1.435,1; 2 -1.435,0.5; 3 -1.435,0; 4 -1.435,-0.5; 5 -1.435,-1; 6 1.435,-1; 7 1.435,-0.5; 8 1.435,0; 9 1.435,0.5; 10 1.435,1 | smd 1.65 x 2.6: 11 0,0
47589-0001 = smd 1.35 x 0.4: 1 2.7,1.3; 2 2.7,0.65; 3 2.7,0; 4 2.7,-0.65; 5 2.7,-1.3 | drill 1.1 pad 1.6: CASING1 0,3.5; CASING2 0,-3.5 | drill 0.85 pad 1.25: CASING3 2.7,2.5; CASING4 2.7,-2.5 | smd 1.55 x 1.2: P$1 0,2.9; P$4 0,-2.9 | smd 1.55 x 1.5: P$2 0,1; P$3 0,-1
CSTCE8M00G55 = smd 0.4 x 2.1: 1 -1.2,0; 2 0,0; 3 1.2,0

### Placement (x,y rotation side)
B1  31.37,15.24 180 bottom
C1  94,26.4 0 top
C2  94,15.4 0 top
C3  81.18,13.65 180 bottom
C4  43.94,56.03 180 top  (outside the outline)
C5  82.28,19.9 270 bottom
C6  83,-12.2 270 bottom  (outside the outline)
C7  35.64,32.32 270 bottom
C8  35,13.9 90 bottom
C9  75.1,8 0 bottom
C10  34.4,26.9 0 top
C11  85.31,18.51 270 bottom
C12  85.6,-13.2 270 bottom  (outside the outline)
C13  47.13,4.31 0 top
C14  [C0603']  -28.57,-31.88 0 top  (outside the outline)
C15  [C0603']  34.08,46.08 90 bottom
C16  [C0603']  39.75,5.97 270 top
C17  [C0603']  46.15,16.37 180 top
C18  35.09,54.23 180 top  (outside the outline)
C19  16.64,12.32 90 bottom
C20  31.62,36.58 270 top
C21  29.21,26.8 90 bottom
C22  -14.76,19.95 180 bottom  (outside the outline)
C23  27.3,20.07 0 bottom
C24  21.12,19.26 315 top
C25  29.83,25.03 135 top
C26  22.64,29.69 0 bottom
C27  34.05,-4.16 90 bottom  (outside the outline)
C28  40.4,-3.5 90 top
C29  31.37,13.21 0 bottom
C30  23.37,-2.41 0 top
C31  [C0603']  82.1,-21 90 bottom  (outside the outline)
C33  19.72,36.04 180 top
C34  11.58,48.07 0 top
C36  14.09,42.05 180 bottom
CN1  42,9.4 180 top
CN2  53.25,9.4 180 top
D1  62.44,-2.26 270 bottom
D2  87.3,-24.8 180 bottom  (outside the outline)
D3  77.8,-21.9 180 top  (outside the outline)
D4  -28.4,-35.8 0 top  (outside the outline)
D5  56.2,31.5 180 bottom
D6  -7.4,-11.7 0 top  (outside the outline)
D9  48.07,-8.46 0 top  (outside the outline)
D10  50.61,-8.46 0 top  (outside the outline)
D11  53.15,-8.46 0 top  (outside the outline)
H1  95,45 0 top
H2  95,5 0 top
H3  5,45 0 top
H4  5,5 0 top
IC1  14.6,46.8 90 bottom
IC2  -26.54,-13.97 0 top  (outside the outline)
J1  18.2,12.2 0 top
J4  6,17 90 top
J5  -7.25,35.6 180 top
J6  20.7,56.24 90 top  (outside the outline)
Q1  77.3,26.6 180 bottom
Q2  63,26.6 180 bottom
Q3  84.8,-6.5 270 bottom  (outside the outline)
Q4  78.8,-6.8 90 bottom  (outside the outline)
Q5  20,39.6 90 bottom
R1  86.19,31.45 270 bottom
R2  87.4,-22.8 180 bottom  (outside the outline)
R3  56.2,29.4 180 bottom
R4  77.8,-20.2 180 top  (outside the outline)
R5  66.51,60.34 270 bottom  (outside the outline)
R6  87.4,-20.6 0 bottom  (outside the outline)
R7  81.82,11.06 270 bottom
R8  75.1,-20.8 270 top  (outside the outline)
R9  79.8,-14.8 90 bottom  (outside the outline)
R10  -21.34,-8.89 0 top  (outside the outline)
R11  -21.34,-13.84 0 top  (outside the outline)
R12  16.36,56.46 90 top  (outside the outline)
R13  48.66,19.04 0 top
R14  50.04,15.51 180 top
R15  -28.57,-21.97 0 top  (outside the outline)
R16  -28.57,-26.92 0 top  (outside the outline)
R17  20.1,47.5 0 bottom
R18  20.1,34.8 0 bottom
R19  54.2,26 180 bottom
R20  6.1,28.96 270 bottom
R21  3.56,28.96 90 bottom
R22  79.5,-19.9 180 bottom  (outside the outline)
R23  79.5,-22 180 bottom  (outside the outline)
R28  20.1,36.9 0 bottom
R30  23.88,26.16 270 bottom
R109  48.07,-8.46 270 bottom  (outside the outline)
R110  50.61,-8.46 270 bottom  (outside the outline)
R111  53.15,-8.46 270 bottom  (outside the outline)
R123  37.38,3.45 90 top
S1  -10.03,16.31 90 top  (outside the outline)
U1  42.46,25.23 45 top
U2  17.3,45.9 90 top
U3  21.7,40 90 top
U4  22.62,44.17 180 bottom
U5  49.9,33.4 90 top
U8  49.02,61.85 270 top  (outside the outline)
U9  33.02,60.71 90 top  (outside the outline)
U10  26.02,54.89 270 top  (outside the outline)
U$1  82.6,33.4 0 top
U$2  66.6,33.4 0 top
U$3  80,-24.5 180 bottom  (outside the outline)
U$4  83.4,-20.9 90 top  (outside the outline)
U$5  31.2,3 90 top
X1  33.61,19.57 270 top

### Tracks (layer width: path | path; a pad name or v marks a point on that pad's centre or on a via)
0V  (via drill 0.35)  (3 unrouted)
  other vias: 82,-14.4 82,-15.2 82,-16 82,-16.8 82,-17.6 82.8,-17.6 83.6,-17.6 84.4,-17.6 83.6,-14.4 82.8,-14.4 81.2,-17.6 81.2,-16.8 80.4,-17.6 80.4,-16.8 79.6,-16.8 79.6,-17.6
  pour Top (rank 3, no thermals): 86.8,20.8 57.3,20.8 57.3,14.8 86.8,14.8
  pour Bottom (rank 3, no thermals): 87.3,-13.8 78.7,-13.8 78.7,-18 87.3,-18
3V3A  (8 unrouted)
5V_ISO  (via drill 0.35)  (3 unrouted)
  Top 0.254: U3.8 19,38.09 | 19,38.09 18.1,38.09 17.2,38.99 17.2,46.53 U2.3 | v11.8,45.3 12,45.5 12,47.55 12.25,47.8 U2.5 16.3,47.8 17.2,46.91 17.2,46.3 | C33.2 18.87,37.97 19,38.09
  Bottom 0.254: IC1.1 11.8,45.35 v11.8,45.3
!EMS  (2 unrouted)
!EMS_ISO  (3 unrouted)
  Bottom 0.152: 13.7,32.9 14.8,34 17.1,34 18,34.9 18,35.5 18.65,36.15
!RESET  (2 unrouted)
+3V3  (via drill 0.35)  (15 unrouted)
  Top 0.254: 27.43,26.8 v28.89,28.26 29.08,28.45 | 43.63,30.28 U1.36
  Bottom 0.254: C26.2 22,29.69 | v28.89,28.26 29.21,27.94 C21.2 29.25,27.69 31.37,27.69 | 31.37,26.92 31.37,27.69 | 31.37,32.38 31.37,27.69 | v31.62,26.92 31.37,26.92 | 31.37,26.92 31.11,26.67
  Bottom 0.508: 26.29,20.13 C23.2
+5V  (4 unrouted)
+15V  (8 unrouted)
A_LS  (4 unrouted)
  pour Bottom (no thermals): 76.06,17.39 80.63,17.39 80.63,24 76.06,24
A_OUT  (7 unrouted)
B_LS  (1 unrouted)
  pour Bottom (rank 4, no thermals): 83.9,-8.4 83.9,-13.4 77.5,-13.4 77,-12.9 77,-8.4
B_OUT  (7 unrouted)
CANH  (1 unrouted)
  Top 0.254: 11.16,27.8 14.1,30.74 14.1,42.3 13.6,42.8 13.6,45.06 13.8,45.27 U2.7
CANL  (1 unrouted)
  Top 0.254: 11.6,28.82 13.6,30.82 13.6,42.2 13.1,42.7 13.1,45.53 14.1,46.53 U2.6
CANRX  (2 unrouted)
  Top 0.152: 30.86,27.94 30.86,31.5 30.48,31.88 30.48,32.64 30.23,32.89
CANRX_ISO
  Top 0.254: U2.4 20.8,47.8 21.1,47.51 21.1,41.23 20.5,40.63 U3.6
CANTX  (2 unrouted)
  Top 0.152: 30.48,28.07 30.48,31.37 30.23,31.62
CANTX_ISO
  Top 0.254: U3.7 18.1,39.37 17.8,39.66 17.8,43.7 18.1,43.99 U2.1
DC_ISO  (via drill 0.35)  (4 unrouted)
  Top 0.508: 12.4,32.1 v12.4,41.1 v12.4,41.9
  Bottom 0.152: R20.1 6.18,29.81 7.37,30.99 8.13,30.99
  Bottom 0.508: C36.1 11.45,42.05 10.5,43 10.5,47.7 11.1,48.3 IC1.3
GNDA  (via drill 0.35, 0.4)  (36 unrouted)
  Bottom 0.152: 15.03,36.45 9.53,36.45 4.45,31.37 4.45,26.67 3.68,25.91 3.68,21.97
  other vias: 84.46,-15.7 26.67,27.94 28.19,28.96 24.64,13.84 23.37,12.32 54.42,-8.46 51.88,-8.46 49.34,-8.46 46.8,-8.46 7.62,10.16 22.86,10.16 5.08,10.16 2.54,10.16 27.94,35.56 27.94,38.1 84.46,-25.86 29.84,29.34 28.19,26.67 25.65,25.53 22.86,23.88 30.48,26.54 23.11,17.78 21.59,22.61 26.67,18.41 26.54,12.32 18.29,19.3 19.94,21.21 15.88,15.37 30.48,40.64 27.94,40.64 42.99,-6.81 54.42,-6.05 51.88,-6.05 17.78,12.7 23.5,15.49 19.3,16.38 20.32,12.32 30.48,20.32 24.13,27.94 26.67,25.4 15.24,20.32
  pour Top (rank 6): 0,0 0,21.97 17.6,21.9 18.3,22.6 18.3,31.7 19.2,32.6 25.3,32.6 27.5,34.8 27.5,49.7 99.88,49.64 99.88,0
  pour Bottom (rank 6): 27.5,49.7 99.88,49.72 99.88,0 0,0 0,21.97 17.6,21.9 18.3,22.6 18.3,31.7 19.2,32.6 25.3,32.6 27.5,34.8
GNDIO  (via drill 0.35)  (13 unrouted)
  other vias: 16.49,32.02 14.22,27.3 17.43,32.45 16.18,30 15.75,28.57 12.19,27.3 22.48,32.13 12.32,25.53 2.54,22.99 2.54,25.4 2.41,27.94 5.08,27.05 7.62,28.7 10.16,27.05 7.62,30.1 5.08,30.61 2.54,30.48 2.54,33.02 15.24,33.02 2.54,35.56 2.54,38.1 2.54,40.64 7.62,40.64 10.16,40.64 9.76,43.18 9.76,45.72 17.78,48.26 10.46,48.96 15.14,48.91 20.9,38.54 17.9,45.9 17.08,23.06 18.4,42.96 22.86,35.56 7.62,33.02 16.94,48.52 20.12,32.66 19.22,33.24 21.21,31.62 26.67,31.75 17.87,44.69 4.57,22.99 16.89,37.21 13.97,24.13 17.99,33.61 21.21,34.04 6.35,31.75 5.08,35.56 19.68,48.9 11.26,46.02 11.26,46.92 16.46,46.62 16.46,44.82 13.06,46.82 11.36,43.42 12.46,44.22 15.76,42.82 15.76,42.02 15.76,41.22
  pour Bottom (rank 5): 0.5,49.5 22.3,49.5 22.3,33.5 19.5,33.5 17.6,31.6 17.6,23 17.2,22.6 0.5,22.6
  pour Top (rank 5): 0.5,22.6 0.5,49.5 22.3,49.5 22.3,33.5 19.5,33.5 17.6,31.6 17.6,23 17.2,22.6
ISENSE
  Top 0.254: 43.73,20.77 U1.14
ISENSE_B  (1 unrouted)
JMP0  (1 unrouted)
JMP1  (1 unrouted)
JMP2  (1 unrouted)
JMP3  (1 unrouted)
JMP4  (1 unrouted)
LED0  (1 unrouted)
  Bottom 0.152: R109.1 46.55,-7.61
LED1  (1 unrouted)
  Bottom 0.152: R110.1 49.81,-6.81 46.8,-6.81
LED2  (1 unrouted)
  Bottom 0.152: R111.1 52.35,-6.81 50.36,-6.81 49.98,-6.43 46.67,-6.43
LED_CAN  (via drill 0.35)  (1 unrouted)
  Top 0.152: 14.61,21.97 10.67,25.91 9.02,25.91 7.24,27.69 v3.56,27.69
  Bottom 0.152: v3.56,27.69 R21.1
N$1  (3 unrouted)
N$2  (3 unrouted)
N$3  (via drill 0.35)
  Top 0.254: v50.61,-9.73 D10.A
  Bottom 0.254: R110.2 v50.61,-9.73
N$4  (2 unrouted)
N$5  (3 unrouted)
N$7  (via drill 0.35)
  Top 0.254: D9.A v48.07,-9.73
  Bottom 0.254: v48.07,-9.73 R109.2
N$8  (1 unrouted)
  Bottom 0.152: 19,38.65 Q5.1
N$9  (1 unrouted)
N$10  (1 unrouted)
N$11  (3 unrouted)
N$12  (2 unrouted)
N$14  (2 unrouted)
N$15  (1 unrouted)
  Bottom 0.152: R22.2 80.6,-20.15 C31.2
N$16  (1 unrouted)
N$17
  Bottom 0.254: Q5.3 20.7,39.6 20.7,45.03 20.29,45.44 U4.2
N$18  (via drill 0.35)  (1 unrouted)
  Top 0.152: 15.19,26.87 14.61,26.29 9.14,26.29 7.11,28.32 v6.1,28.32
  Bottom 0.152: R20.2 v6.1,28.32
N$19  (1 unrouted)
N$20  (1 unrouted)
  Bottom 0.152: 14.15,36.96 9.53,36.96 3.94,31.37 3.94,29.81 R21.2
N$21  (via drill 0.35)
  Top 0.254: D11.A v53.15,-9.73
  Bottom 0.254: v53.15,-9.73 R111.2
N$22  (1 unrouted)
  Bottom 0.152: C31.1 80.5,-21.85 R23.2
N$24  (1 unrouted)
N$61  (2 unrouted)
N$64  (2 unrouted)
  Bottom 0.254: Q4.4 76.9,-17.4
N$67  (1 unrouted)
N$73  (2 unrouted)
REF  (2 unrouted)
SWCLK  (1 unrouted)
SWDIO  (1 unrouted)
VCC  (via drill 0.35)  (11 unrouted)
  other vias: 83.8,-8.2 84.9,24.8
  pour Top (rank 3, no thermals): 86.56,27.65 57.03,27.65 57.03,23.47 86.52,23.47
  pour Bottom (no thermals): 87.9,-13.6 87.9,-5.8 82.6,-5.8 82.6,-10.2 84,-11.6 84,-13.6
VCS_B_N
  Bottom 0.152: R22.1 78.5,-19.75 R9.1S
VCS_B_P
  Bottom 0.152: R9.2S 78.5,-15.7 77.8,-16.4 77.8,-21.1 78.65,-21.95 R23.1
VSENSE  (3 unrouted)

### Text on the board
tPlace: DBG | EMoCON | Chirpy Chloe | by YskHara / 1st, Feb. '19.
tNames: RST | ENC | D-IN | CONF
bNames: OUT- | OUT+ | 3V3 | GND | DIO | 5V | CLK | TX | GND | RX | VM- | VM+ | GND | 5V | ENC_A | ENC_B | GND | 5V | DIN_A | DIN_B